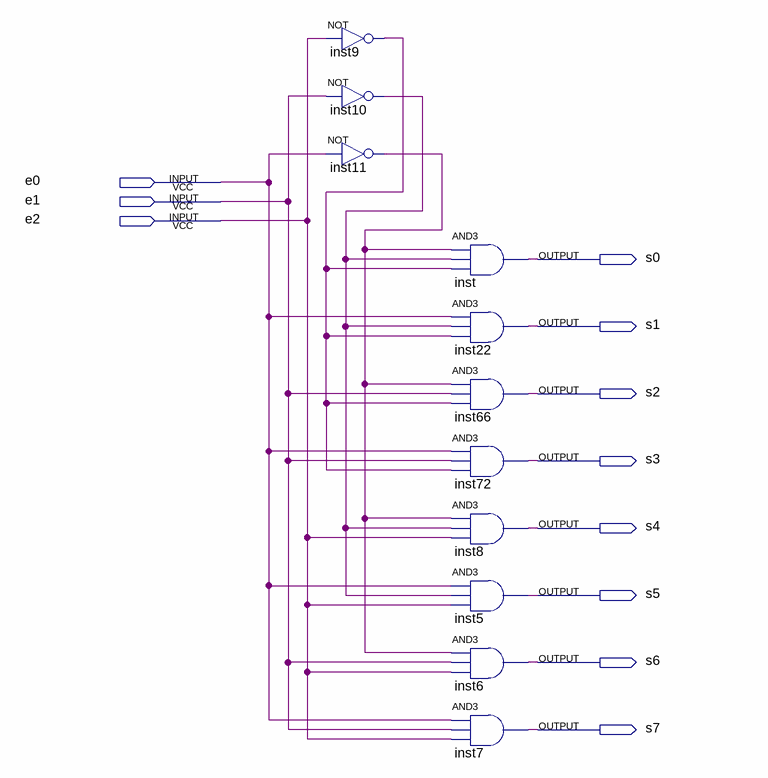
[diagram p0: schematic sheet]
// Quartus schematic decod3x8.bdf as structural Verilog: 11 symbols, 11 pins
module decod3x8 (
  input  e0,
  input  e1,
  input  e2,
  output s0,
  output s1,
  output s2,
  output s3,
  output s4,
  output s5,
  output s6,
  output s7
);

  wire inst9_out, inst10_out, inst11_out;

  not inst9 (inst9_out, e2);
  not inst10 (inst10_out, e1);
  not inst11 (inst11_out, e0);
  and inst (s0, inst11_out, inst10_out, inst9_out);
  and inst22 (s1, e0, inst10_out, inst9_out);
  and inst66 (s2, inst11_out, e1, inst9_out);
  and inst72 (s3, e0, e1, inst9_out);
  and inst8 (s4, inst11_out, inst10_out, e2);
  and inst5 (s5, e0, inst10_out, e2);
  and inst6 (s6, inst11_out, e1, e2);
  and inst7 (s7, e0, e1, e2);
endmodule
